# EAGLE design MODUL_LAN_V102 (EAGLE 6.4)
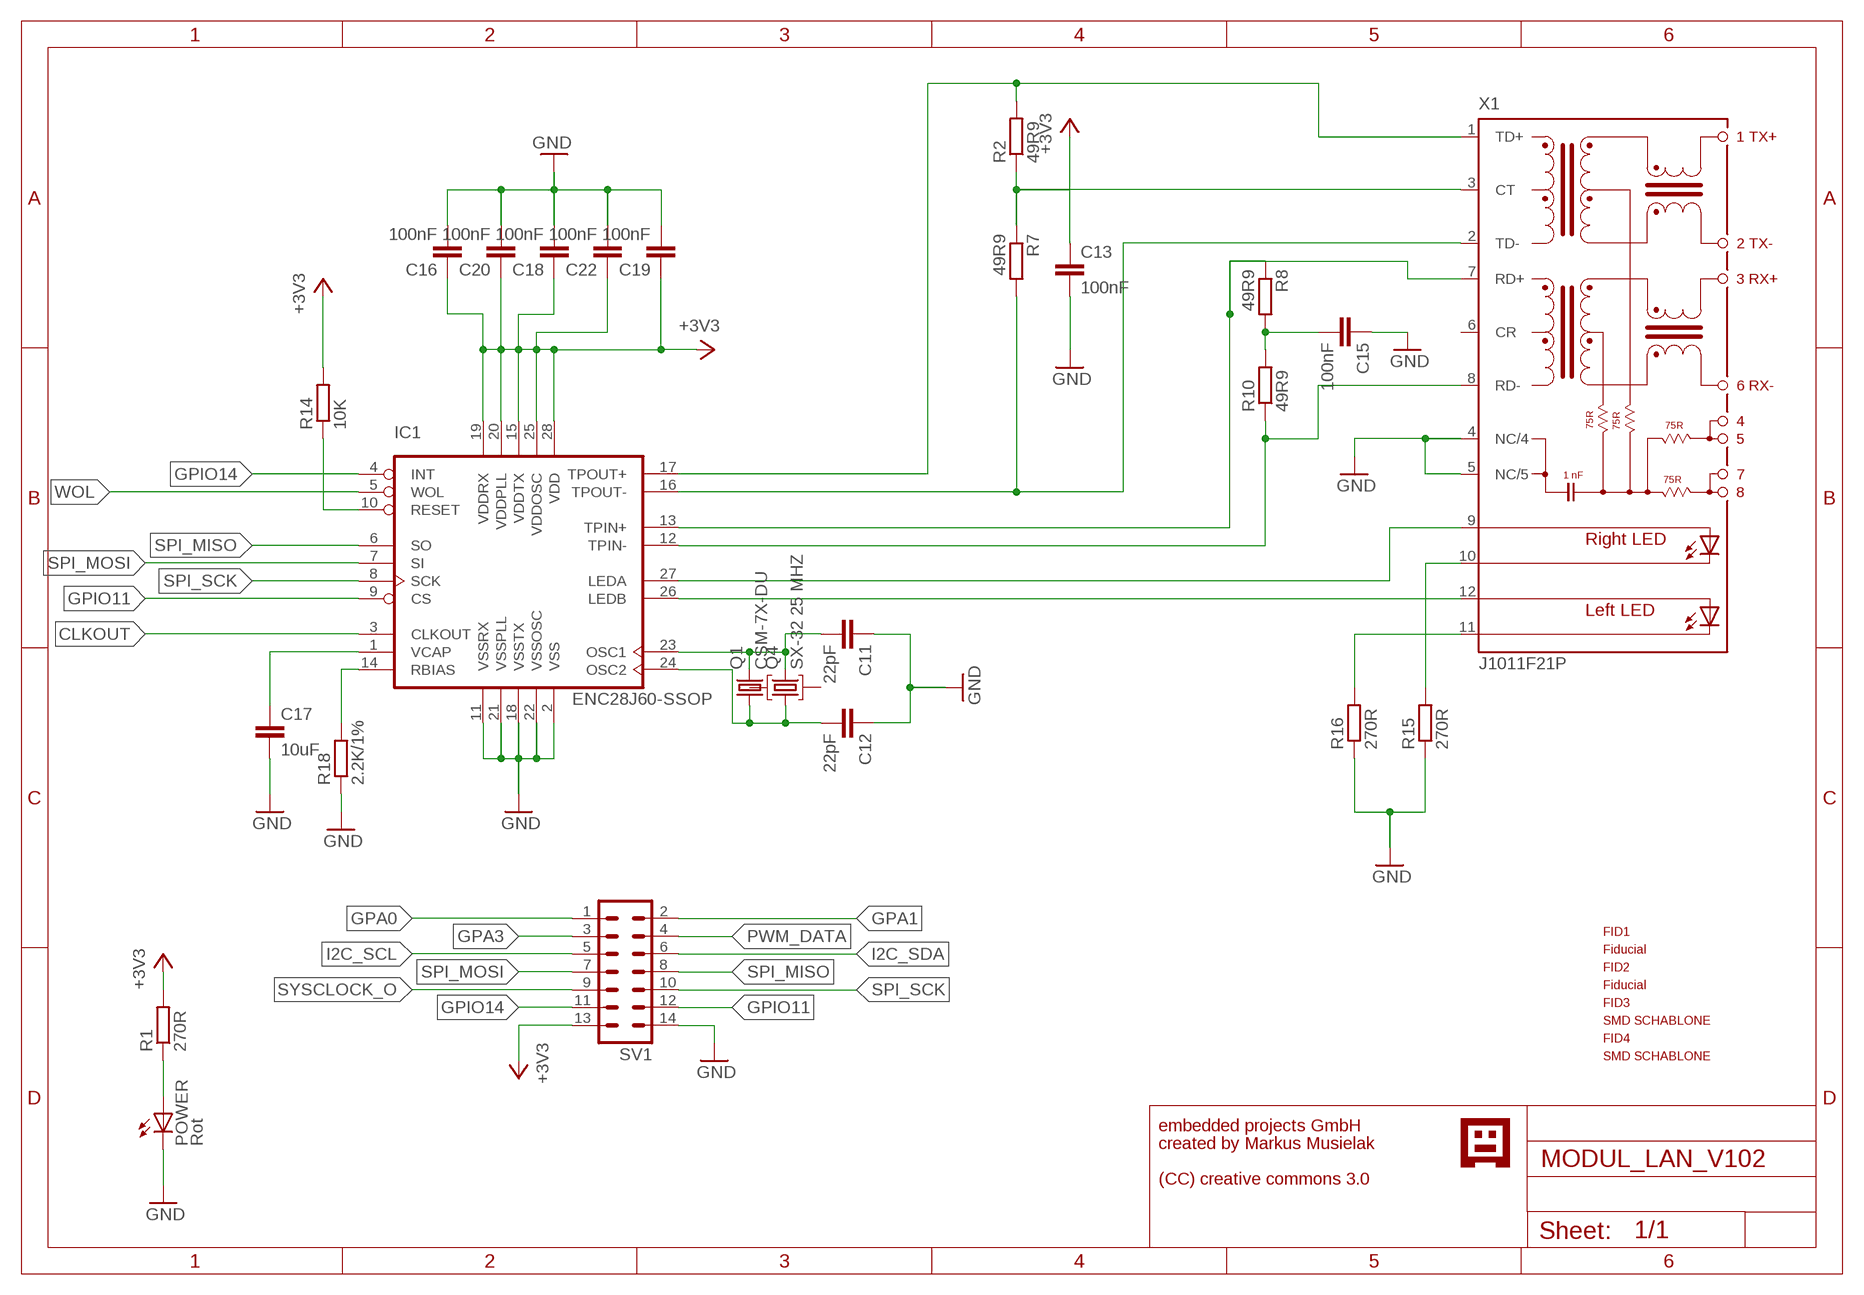
[diagram p0: schematic, sheet 1]

## Parts
C11  22pF  C-EUC0805  [C0805]
C12  22pF  C-EUC0805  [C0805]
C13  100nF  C-EUC0805  [C0805]
C15  100nF  C-EUC0805  [C0805]
C16  100nF  C-EUC0805  [C0805]
C17  10uF  C-EUC0805  [C0805]
C18  100nF  C-EUC0805  [C0805]
C19  100nF  C-EUC0805  [C0805]
C20  100nF  C-EUC0805  [C0805]
C22  100nF  C-EUC0805  [C0805]
FID1  PASSERMARKEN_FIDUCIAL  [PASSERMARKEN_FIDUCIAL]
FID2  PASSERMARKEN_FIDUCIAL  [PASSERMARKEN_FIDUCIAL]
FID3  PASSERMARKEN_FIDUCIAL  [PASSERMARKEN_FIDUCIAL]
FID4  PASSERMARKEN_FIDUCIAL  [PASSERMARKEN_FIDUCIAL]
IC1  ENC28J60-SSOP  [SSOP28]
POWER  Rot  LEDCHIP-LED0805  [CHIP-LED0805]
Q1  CSM-7X-DU  [CSM-7X-DU]
Q4  SX-32 25 MHZ  SX-32  [SX-32]
R1  270R  R-EU_R0805  [R0805]
R2  49R9  R-EU_R0805  [R0805]
R7  49R9  R-EU_R0805  [R0805]
R8  49R9  R-EU_R0805  [R0805]
R10  49R9  R-EU_R0805  [R0805]
R14  10K  R-EU_R0805  [R0805]
R15  270R  R-EU_R0805  [R0805]
R16  270R  R-EU_R0805  [R0805]
R18  2.2K/1%  R-EU_R0805  [R0805]
SV1  ML14  [ML14]
U$2  GNUBLINLOGOSIEB  [GNUSIEBDRUCK]
X1  J1011F21P  [J1]

## Nets
+3V3: C13.1 C16.1 C18.1 C19.1 C20.1 C22.1 IC1.15(VDDTX) IC1.19(VDDRX) IC1.20(VDDPLL) IC1.25(VDDOSC) IC1.28(VDD) R1.2 R2.1 R7.1 R14.2 SV1.13 X1.3(CT)
CLKOUT: IC1.3(CLKOUT)
GND: C11.1 C12.1 C13.2 C15.1 C16.2 C17.2 C18.2 C19.2 C20.2 C22.2 IC1.2(VSS) IC1.11(VSSRX) IC1.18(VSSTX) IC1.21(VSSPLL) IC1.22(VSSOSC) POWER.C R15.1 R16.1 R18.1 SV1.14 X1.4(NC/4) X1.5(NC/5)
GPA0: SV1.1
GPA1: SV1.2
GPA3: SV1.3
GPIO11: IC1.9(CS) SV1.12
GPIO14: IC1.4(INT) SV1.11
I2C_SCL: SV1.5
I2C_SDA: SV1.6
LINKACT: R15.2 X1.10(C-R)
N$1: C15.2 R8.2 R10.2
N$2: POWER.A R1.1
N$5: IC1.10(RESET) R14.1
N$10: C17.1 IC1.1(VCAP)
N$11: IC1.27(LEDA) X1.9(A-R)
N$12: IC1.26(LEDB) X1.12(AL)
N$16: IC1.14(RBIAS) R18.2
PWM_DATA: SV1.4
RX+: IC1.13(TPIN+) R8.1 X1.7(RD+)
RX-: IC1.12(TPIN-) R10.1 X1.8(RD-)
SPEED: R16.2 X1.11(C-L)
SPI_MISO: IC1.6(SO) SV1.8
SPI_MOSI: IC1.7(SI) SV1.7
SPI_SCK: IC1.8(SCK) SV1.10
SYSCLOCK_O: SV1.9
TX+: IC1.17(TPOUT+) R2.2 X1.1(TD+)
TX-: IC1.16(TPOUT-) R7.2 X1.2(TD-)
WOL: IC1.5(WOL)
XT1: C12.2 IC1.24(OSC2) Q1.1 Q4.1
XT2: C11.2 IC1.23(OSC1) Q1.2 Q4.3
Unconnected: Q4.2 Q4.4 X1.6(CR)

## Notes on the sheet
- embedded projects GmbH
- created by Markus Musielak
- (CC) creative commons 3.0

## Library data of the parts
C11-C13 C15-C20 C22 = rcl:C-EU: CAPACITOR, European symbol
FID1 FID2 = KUBUS3:PASSERMARKEN_FIDUCIAL: SMD Passermarke
FID3 FID4 = SMDSCHABLONE:PASSERMARKEN_FIDUCIAL: SMD Passermarke
IC1 = enc28j60:ENC28J60-*: Microchip 10Mbit Ethernet controller with SPI interface Improved SOIC28 layout (pads in 0.01 raster, pin1 slightly smaller). Pin 6 (SO) changed from Out (paralleling several Outs gives an error) to OC. Author: Profi from mikrocontroller.net - forum Date: 2006.0827; FARNELL: 1084620
POWER = led:LED: LED OSRAM: - CHIPLED LG R971, LG N971, LY N971, LG Q971, LY Q971, LO R971, LY R971 LH N974, LH R974 LS Q976, LO Q976, LY Q976 LO Q996 - Hyper CHIPLED LW Q18S LB Q993, LB Q99A, LB R99A - SideLED LS A670, LO A670, LY A670, LG A670, LP A670 LB A673, LV A673, LT A673, LW A673 LH A674 LY A675 LS A676, LA A676, LO A676, LY A676, LW A676 LS A679, LY A679, LG A679 - Hyper Micro SIDELED® LS Y876, LA Y876, LO Y876, LY Y876 LT Y87S - SmartLED LW L88C, LW L88S LB L89C, LB L89S, LG L890 LS L89K, LO L89K, LY L89K LS L896, LA L896, LO L896, LY L896 - TOPLED LS T670, LO T670, LY T670, LG T670, LP T670 LSG T670, LSP T670, LSY T670, LOP T670, LYG T670 LG T671, LOG T671, LSG T671 LB T673, LV T673, LT T673, LW T673 LH T674 LS T676, LA T676, LO T676, LY T676, LB T676, LH T676, LSB T676, LW T676 LB T67C, LV T67C, LT T67C, LS T67K, LO T67K, LY T67K, LW E67C LS E67B, LA E67B, LO E67B, LY E67B, LB E67C, LV E67C, LT E67C LW T67C LS T679, LY T679, LG T679 LS T770, LO T770, LY T770, LG T770, LP T770 LB T773, LV T773, LT T773, LW T773 LH T774 LS E675, LA E675, LY E675, LS T675 LS T776, LA T776, LO T776, LY T776, LB T776 LHGB T686 LT T68C, LB T68C - Hyper Mini TOPLED® LB M676 - Mini TOPLED Santana® LG M470 LS M47K, LO M47K, LY M47K Source: http://www.osram.convergy.de LUXEON: - LUMILED® LXK2-PW12-R00, LXK2-PW12-S00, LXK2-PW14-U00, LXK2-PW14-V00 LXK2-PM12-R00, LXK2-PM12-S00, LXK2-PM14-U00 LXK2-PE12-Q00, LXK2-PE12-R00, LXK2-PE12-S00, LXK2-PE14-T00, LXK2-PE14-U00 LXK2-PB12-K00, LXK2-PB12-L00, LXK2-PB12-M00, LXK2-PB14-N00, LXK2-PB14-P00, LXK2-PB14-Q00 LXK2-PR12-L00, LXK2-PR12-M00, LXK2-PR14-Q00, LXK2-PR14-R00 LXK2-PD12-Q00, LXK2-PD12-R00, LXK2-PD12-S00 LXK2-PH12-R00, LXK2-PH12-S00 LXK2-PL12-P00, LXK2-PL12-Q00, LXK2-PL12-R00 Source: www.luxeon.com KINGBRIGHT: KA-3528ASYC Source: www.kingbright.com
Q1 = crystal:CSM-7X-DU: SMD CRYSTAL Source: www.ecsxtal.com .. Crystal 3.6864MHz CSM_7X_DU.PDF; OC_FARNELL: unknown; OC_NEWARK: unknown
Q4 = KUBUS3B_PARTS2:SX-32: SMD CRYSTAL; FARNELL: 1712841
R1 R2 R7 R8 R10 R14-R16 R18 = resistor:R-EU_: RESISTOR, European symbol
SV1 = con-ml:ML14: HARTING; OC_FARNELL: unknown; OC_NEWARK: unknown
U$2 = EmbeddedProjectsLogos2:GNUBLINLOGO
X1 = con-pulse:J1011F: PULSEJACK (TM) 1x1 Tab-UP RJ45 10/100 Base-TX RJ45 1x1 Tab-UP with LEDs 8-pin (J1 series) and 6-pin (JP series) integrated magnetics connector, designed to support applications, such as ADSL modems, LAN-on-Motherboard, and Hub and Switches. Source: www.pulseeng.com .. PulseJack-J402.pdf; OC_FARNELL: unknown; OC_NEWARK: unknown

## Net classes
1 500mA: width 0.3 mm, drill 0.3 mm, clearance 0.15 mm

## Board
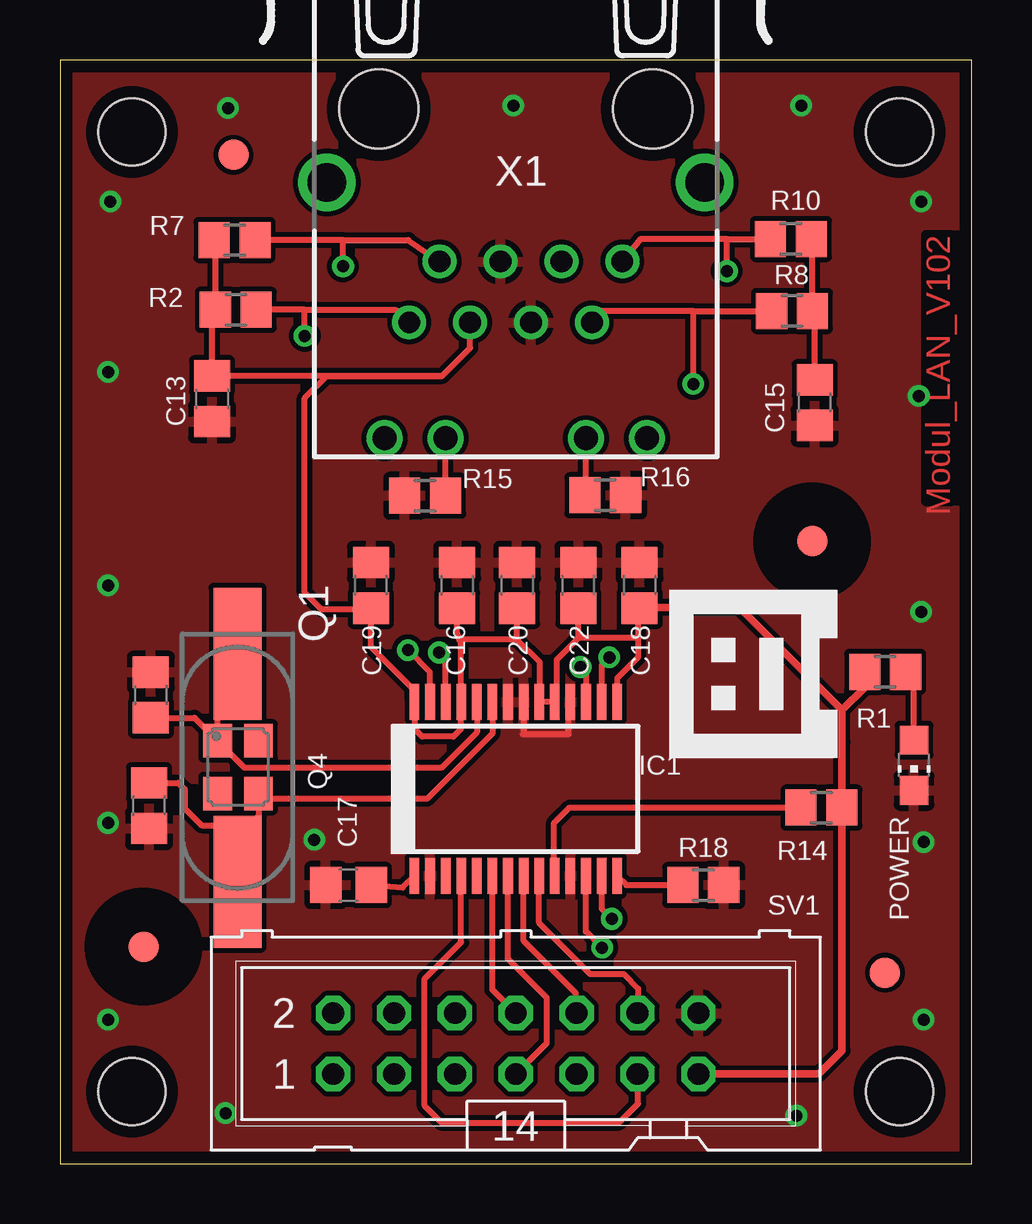
[diagram p1: board, top side]
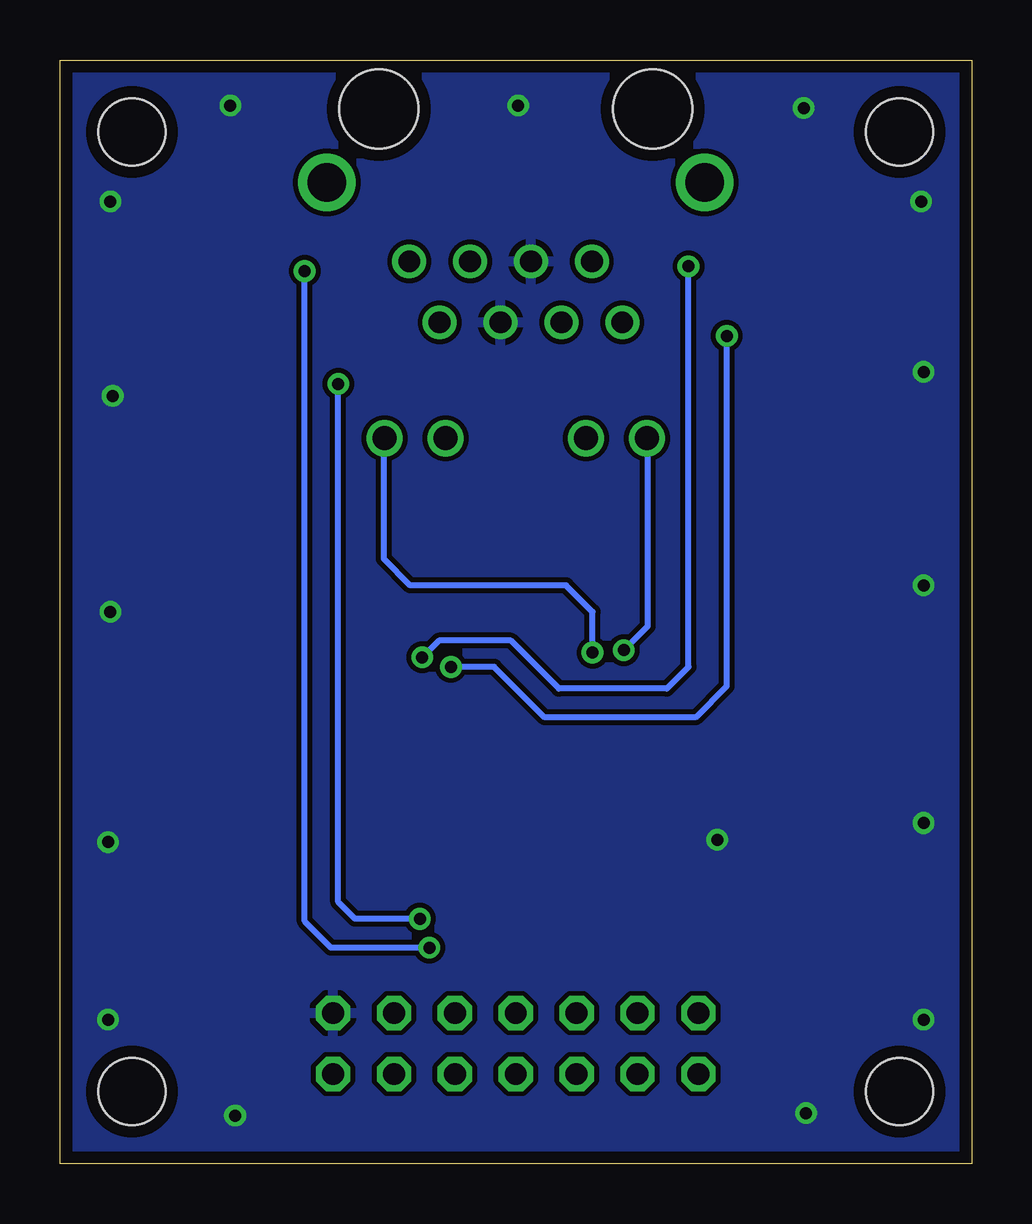
[diagram p2: board, bottom side, seen from below]

Size 38 x 46 mm. Coordinates in mm from the lower left corner, seen from the top.
Outline: 0,0 38,0 38,46 0,46 0,0
Copper layers (1*16): Top 0.035mm / dielectric 1.5mm / Bottom 0.035mm
Design rules "default *": minimum track width 10mil, minimum drill 24mil, track to track 8mil, track to pad 8mil, pad to pad 8mil, via to via 8mil, smd to smd 8mil, copper to edge 20mil, drill to drill 8mil, minimum pad ring 10mil, minimum via ring 8mil, stop-mask expansion 4mil, vias tented up to drill 0mil, thermal gap 10mil
Holes 2.8 mm at 3,3 35,3 35,43 3,43

### Footprints (pad centres in the part's own frame; a part is rotated, then mirrored left to right if it is on the bottom)
C0805 = smd 1.3 x 1.5: 1 -0.95,0; 2 0.95,0
PASSERMARKEN_FIDUCIAL = smd 1.27 x 1.27: 1 0,0
SSOP28 = smd 0.4 x 1.5: 1 -4.225,-3.625; 2 -3.575,-3.625; 3 -2.925,-3.625; 4 -2.275,-3.625; 5 -1.625,-3.625; 6 -0.975,-3.625; 7 -0.325,-3.625; 8 0.325,-3.625; 9 0.975,-3.625; 10 1.625,-3.625; 11 2.275,-3.625; 12 2.925,-3.625; 13 3.575,-3.625; 14 4.225,-3.625; 15 4.225,3.625; 16 3.575,3.625; 17 2.925,3.625; 18 2.275,3.625; 19 1.625,3.625; 20 0.975,3.625; 21 0.325,3.625; 22 -0.325,3.625; 23 -0.975,3.625; 24 -1.625,3.625; 25 -2.275,3.625; 26 -2.925,3.625; 27 -3.575,3.625; 28 -4.225,3.625
CHIP-LED0805 = smd 1.2 x 1.2: A 0,-1.05; C 0,1.05
CSM-7X-DU = smd 5.5 x 2: 1 -4.75,0; 2 4.75,0
SX-32 = smd 1.4 x 1.2: 1 -1.1,-0.85; 2 1.1,-0.85; 3 1.1,0.85; 4 -1.1,0.85
R0805 = smd 1.3 x 1.5: 1 -0.85,0; 2 0.85,0
ML14 = drill 0.914 octagon: 1 -7.62,-1.27; 2 -7.62,1.27; 3 -5.08,-1.27; 4 -5.08,1.27; 5 -2.54,-1.27; 6 -2.54,1.27; 7 0,-1.27; 8 0,1.27; 9 2.54,-1.27; 10 2.54,1.27; 11 5.08,-1.27; 12 5.08,1.27; 13 7.62,-1.27; 14 7.62,1.27
J1 = drill 0.9 pad 1.3: 1 4.445,2.54; 2 3.175,0; 3 1.905,2.54; 4 0.635,0; 5 -0.635,2.54; 6 -1.905,0; 7 -3.175,2.54; 8 -4.445,0 | drill 1 pad 1.422: 9 5.465,7.37; 10 2.925,7.37; 11 -2.925,7.37; 12 -5.465,7.37 | drill 1.6 pad 2.184: M1 -7.875,-3.3; M2 7.875,-3.3 | hole 3.3: 5.715,-6.35; -5.715,-6.35

### Placement (x,y rotation side)
C11  3.71,14.92 90 top
C12  3.79,19.53 270 top
C13  6.34,31.88 270 top
C15  31.46,31.72 90 top
C16  16.56,24.1 90 top
C17  12.03,11.61 180 top
C18  24.16,24.1 90 top
C19  12.96,24.1 90 top
C20  19.06,24.1 90 top
C22  21.61,24.1 90 top
FID1  31.36,25.94 0 top
FID2  3.48,9.04 0 top
FID3  7.23,42.05 0 top
FID4  34.39,7.95 0 top
IC1  19,15.62 0 top
POWER  35.6,16.6 180 top
Q1  7.4,16.5 270 top
Q4  7.42,16.52 270 top
R1  34.4,20.5 180 top
R2  7.33,35.59 0 top
R7  7.28,38.49 0 top
R8  30.52,35.54 0 top
R10  30.47,38.54 0 top
R14  31.74,14.84 0 top
R15  15.22,27.84 0 top
R16  22.73,27.86 180 top
R18  26.82,11.61 180 top
SV1  19,5 0 top
U$2  32.4,16.9 90 top
X1  19,37.6 180 top

### Tracks (layer width: path | path; a pad name or v marks a point on that pad's centre or on a via)
+3V3
  Top 0.254: IC1.15 23.23,20.23 24.1,21.1 24.1,21.9 | 24.1,21.9 24.1,22.89 C18.1 24.18,23.17 | 21.61,21.91 C22.1 | 21.61,21.91 20.7,21 20.7,19.32 IC1.19 IC1.20 20,19.27 20,20.9 19.06,21.84 | 19.06,21.84 C20.1 | 16.56,22.1 16.56,22.04 | 16.56,22.1 16.56,22.04 | 16.56,22.1 16.56,22.04 | 16.56,22.1 C16.1 | 16.56,22.04 16.7,21.7 16.7,19.27 | 16.7,19.27 IC1.25 | 21.61,21.91 24.01,21.91 24.1,21.9 | 19.06,21.84 16.7,21.84 16.56,22.1 | 16.7,19.27 16.7,18.1 16.4,17.8 15.1,17.8 14.8,18.1 14.8,19.22 IC1.28 14.7,19.32 14.7,19.8 12.96,21.54 C19.1 12.91,23.1 10.9,23.1 10.2,23.8 10.2,31.9 11.13,32.83 15.93,32.83 | R7.1 6.48,38.14 R2.1 6.34,35.55 C13.1 15.93,32.83 | 15.93,32.83 17.1,34 X1.3 | 32.6,17.57 32.6,17.53 32.59,17.52
  Top 0.305: SV1.13 31.63,3.73 32.6,4.7 R14.2 32.59,17.52 | R1.2 33.55,19.85 32.6,18.9 | 32.6,17.57 32.6,18.9 | 32.6,18.9 28.33,23.17 24.18,23.17
GND  (via drill 0.5)
  Top 0.254: IC1.21 19.32,17.93 19.3,17.9 21.2,17.9 21.2,19.17 IC1.18
  other vias: 2,6 2,14.2 2,24.1 2,33 2.1,40.1 36,6 36,13.4 35.9,23 35.8,32 35.9,40.1 30.9,44.1 7,44 18.9,44.1 6.9,2.1 30.7,2 10.6,13.5
  pour Bottom: -3,48.8 41.4,48.8 41.4,-2 -3,-2
  pour Top: -2.7,48.5 39.8,48.5 39.8,-1.4 -2.7,-1.4
GPIO11
  Top 0.254: IC1.9 19.98,10.03 22.1,7.9 23.5,7.9 24.1,7.3 24.1,6.29 SV1.12
GPIO14
  Top 0.254: IC1.4 16.73,9.22 15.2,7.7 15.2,2.4 15.9,1.7 23.3,1.7 24.1,2.5 24.1,3.71 SV1.11
LINKACT
  Top 0.254: X1.10 16.07,27.95 R15.2
N$1
  Top 0.254: C15.2 31.46,36.15 R8.2 31.37,38.69 R10.2
N$2
  Top 0.254: POWER.A 35.6,19.85 R1.1
N$5
  Top 0.254: R14.1 21.24,14.84 20.6,14.2 20.6,12.02 IC1.10
N$10
  Top 0.254: C17.1 14.29,11.51 IC1.1
N$11  (via drill 0.5)
  Top 0.254: IC1.27 15.43,20.48 v14.5,21.4
  Bottom 0.254: v14.5,21.4 13.5,22.4 13.5,30.2 X1.9
N$12  (via drill 0.5)
  Top 0.254: IC1.26 16.07,21.02 v15.8,21.3
  Bottom 0.254: v15.8,21.3 15.8,23 16.9,24.1 23.4,24.1 24.5,25.2 24.5,30.09 X1.12
N$16
  Top 0.254: R18.2 23.61,11.61 IC1.14
RX+  (via drill 0.5)
  Top 0.254: 26.4,35.54 22.59,35.54 X1.7 | 26.4,35.54 R8.1 | IC1.13 22.57,10.62 v23,10.2 | v26.4,32.5 26.4,35.54
  Bottom 0.254: v23,10.2 25.7,10.2 26.4,10.9 v26.4,32.5
RX-  (via drill 0.5)
  Top 0.254: 27.7,38.54 24.2,38.54 X1.8 | 27.8,38.54 27.7,38.54 | 27.8,38.54 R10.1 | IC1.12 21.93,9.68 v22.6,9 | v27.8,37.2 27.8,38.54 | 27.8,38.54 27.7,38.54
  Bottom 0.254: v22.6,9 26.7,9 27.8,10.1 v27.8,37.2
SPEED
  Top 0.254: X1.11 21.93,28 R16.2
SPI_MISO
  Top 0.254: IC1.6 18.02,7.25 SV1.8
SPI_MOSI
  Top 0.254: IC1.7 18.68,8.53 20.3,6.9 20.3,5.03 SV1.7
SPI_SCK
  Top 0.254: IC1.8 19.32,9.28 21.5,7.1 21.5,6.31 SV1.10
TX+  (via drill 0.5)
  Top 0.254: 10.2,35.59 R2.2 | 10.2,35.59 13.98,35.59 X1.1 | IC1.17 21.93,20.48 v21.7,20.7 | v10.2,34.5 10.2,35.59
  Bottom 0.254: v21.7,20.7 19.9,20.7 17.8,18.6 11.5,18.6 10.2,19.9 10.2,34.3 v10.2,34.5
TX-  (via drill 0.5)
  Top 0.254: 11.8,38.49 R7.2 | 11.8,38.49 14.52,38.49 X1.2 | IC1.16 22.57,20.77 v22.9,21.1 | v11.8,37.4 11.8,38.49
  Bottom 0.254: v22.9,21.1 22.2,21.8 19.2,21.8 17.2,19.8 12.7,19.8 11.8,20.7 v11.8,37.4
XT1
  Top 0.254: IC1.24 17.38,17.98 15.9,16.5 7.69,16.5 Q4.1 | Q4.1 6.57,20.42 Q1.1 | C12.2 5.61,18.58 Q4.1
XT2
  Top 0.254: IC1.23 18.02,17.93 15.3,15.2 8.29,15.2 8.29,14.49 7.5,13.7 | C11.2 4.93,15.87 5.2,15.6 5.2,14.8 5.9,14.1 7.5,14.1 7.5,13.7 | 7.5,13.7 7.5,12.6 7.6,12.5 7.6,11.95 Q1.2
  Top 0.406: 8.29,15.2 Q4.3

### Text on the board
Top: Modul_LAN_V102
tDocu: www.gnublin.org